# Altium schematic sheet Connector.SchDoc
size A4; SheetNumber: 3; SheetTotal: 3
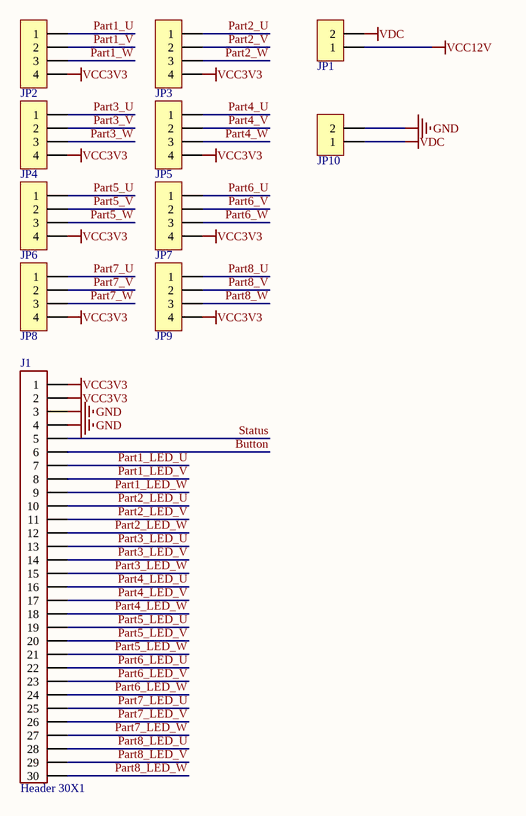
[diagram p0: Connector.SchDoc]

## Parts
J1  Header 30X1  [FPC1.0-2H-WS-30P]
JP1  HDR-1X2  [XH2.54-LI-2P]  (value not drawn)
JP2  HDR-1X4  [XH2.54-LI-4P]  (value not drawn)
JP3  HDR-1X4  [XH2.54-LI-4P]  (value not drawn)
JP4  HDR-1X4  [XH2.54-LI-4P]  (value not drawn)
JP5  HDR-1X4  [XH2.54-LI-4P]  (value not drawn)
JP6  HDR-1X4  [XH2.54-LI-4P]  (value not drawn)
JP7  HDR-1X4  [XH2.54-LI-4P]  (value not drawn)
JP8  HDR-1X4  [XH2.54-LI-4P]  (value not drawn)
JP9  HDR-1X4  [XH2.54-LI-4P]  (value not drawn)
JP10  HDR-1X2  [XH2.54-LI-2P]  (value not drawn)

## Nets
GND: J1.3 J1.4 JP10.2
VCC3V3: J1.1 J1.2 JP2.4 JP3.4 JP4.4 JP5.4 JP6.4 JP7.4 JP8.4 JP9.4
VCC12V: JP1.1
VDC: JP1.2 JP10.1
Button: J1.6
Part1_LED_U: J1.7
Part1_LED_V: J1.8
Part1_LED_W: J1.9
Part1_U: JP2.1
Part1_V: JP2.2
Part1_W: JP2.3
Part2_LED_U: J1.10
Part2_LED_V: J1.11
Part2_LED_W: J1.12
Part2_U: JP3.1
Part2_V: JP3.2
Part2_W: JP3.3
Part3_LED_U: J1.13
Part3_LED_V: J1.14
Part3_LED_W: J1.15
Part3_U: JP4.1
Part3_V: JP4.2
Part3_W: JP4.3
Part4_LED_U: J1.16
Part4_LED_V: J1.17
Part4_LED_W: J1.18
Part4_U: JP5.1
Part4_V: JP5.2
Part4_W: JP5.3
Part5_LED_U: J1.19
Part5_LED_V: J1.20
Part5_LED_W: J1.21
Part5_U: JP6.1
Part5_V: JP6.2
Part5_W: JP6.3
Part6_LED_U: J1.22
Part6_LED_V: J1.23
Part6_LED_W: J1.24
Part6_U: JP7.1
Part6_V: JP7.2
Part6_W: JP7.3
Part7_LED_U: J1.25
Part7_LED_V: J1.26
Part7_LED_W: J1.27
Part7_U: JP8.1
Part7_V: JP8.2
Part7_W: JP8.3
Part8_LED_U: J1.28
Part8_LED_V: J1.29
Part8_LED_W: J1.30
Part8_U: JP9.1
Part8_V: JP9.2
Part8_W: JP9.3
Status: J1.5

## Library data of the parts
JP1 JP10 = Header 2: 2P接插件; 版权归属: 源创客; BOM名称: 2P接插件; 学习资源: www.ooocke.com
JP2-JP9 = Header 4: 4P接插件; 版权归属: 源创客; BOM名称: 4P接插件; 学习资源: www.ooocke.com